# EAGLE schematic LibreServo-v2.2 (EAGLE 7.6.0)
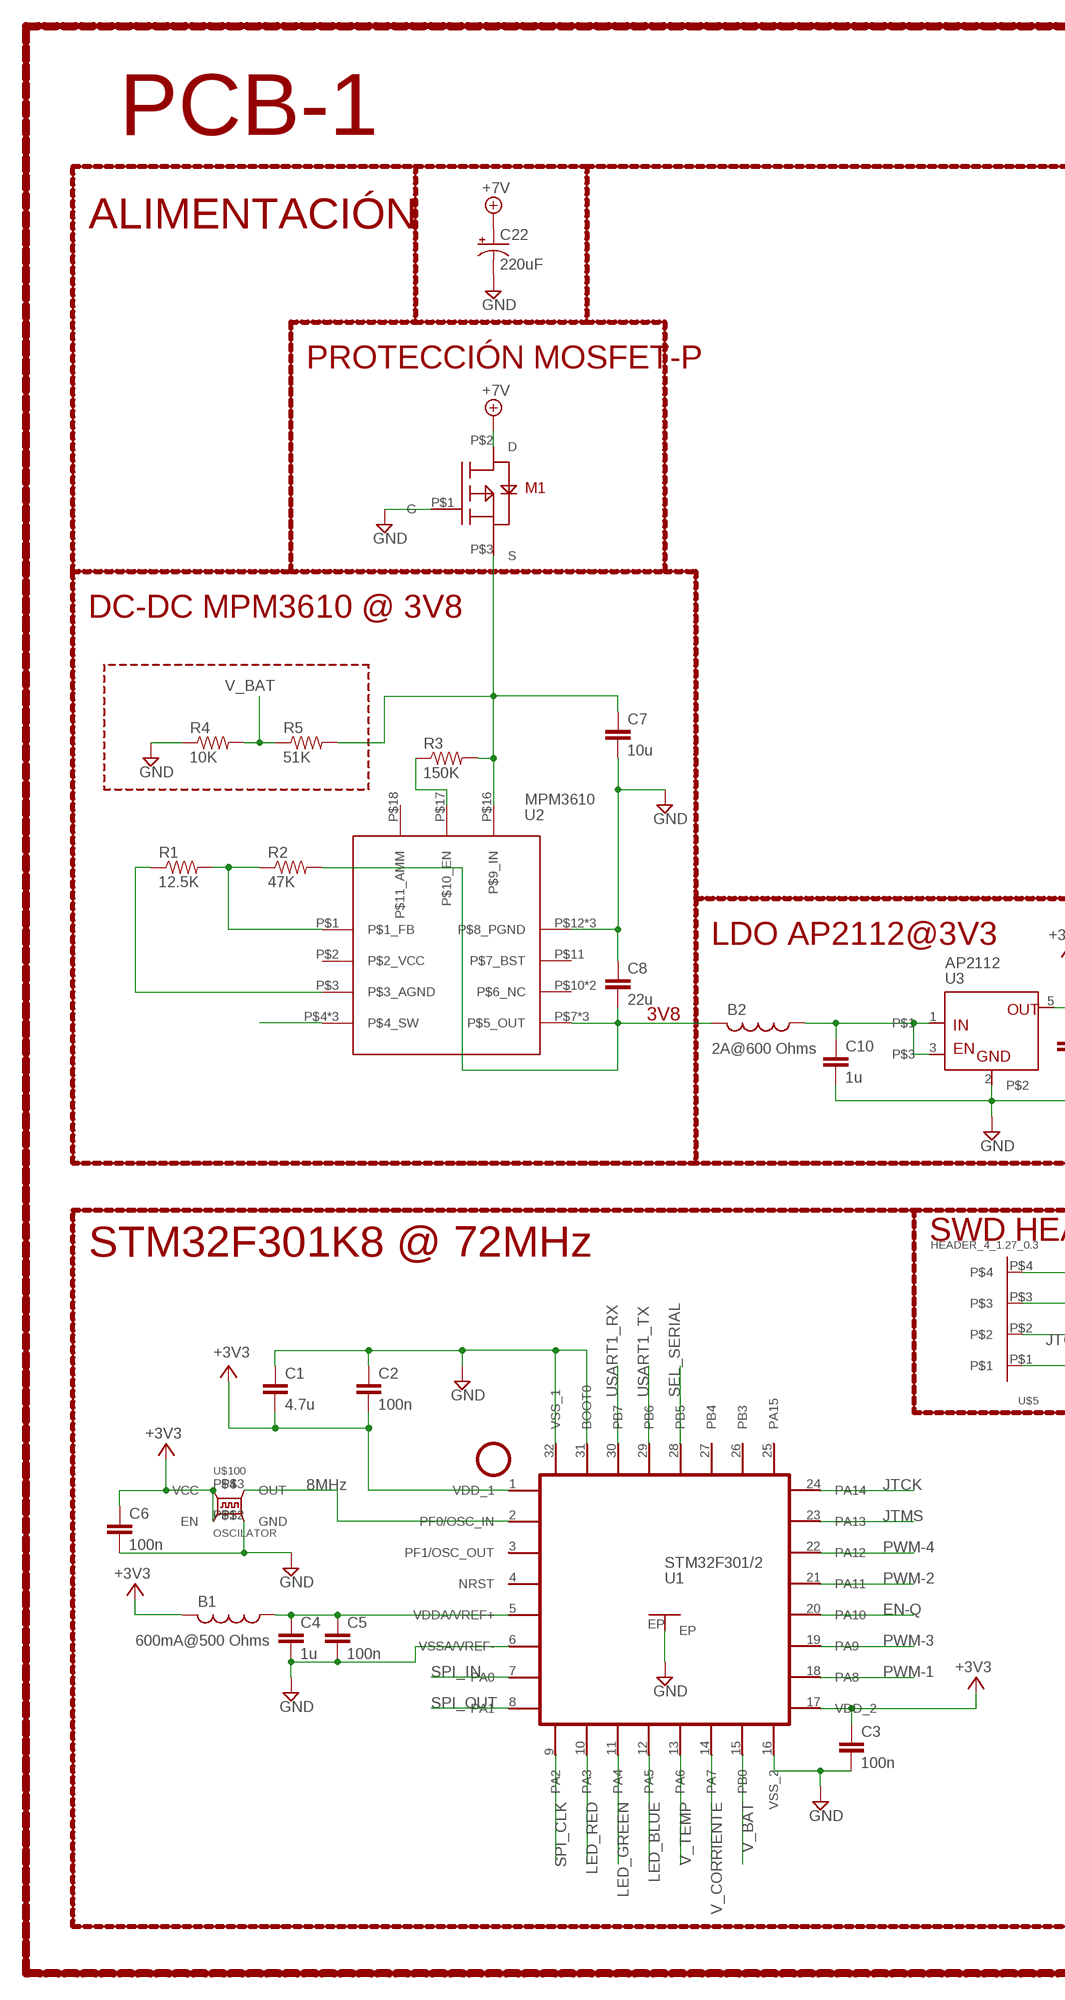
[diagram p0: schematic, sheet 1, part 1 of 2]
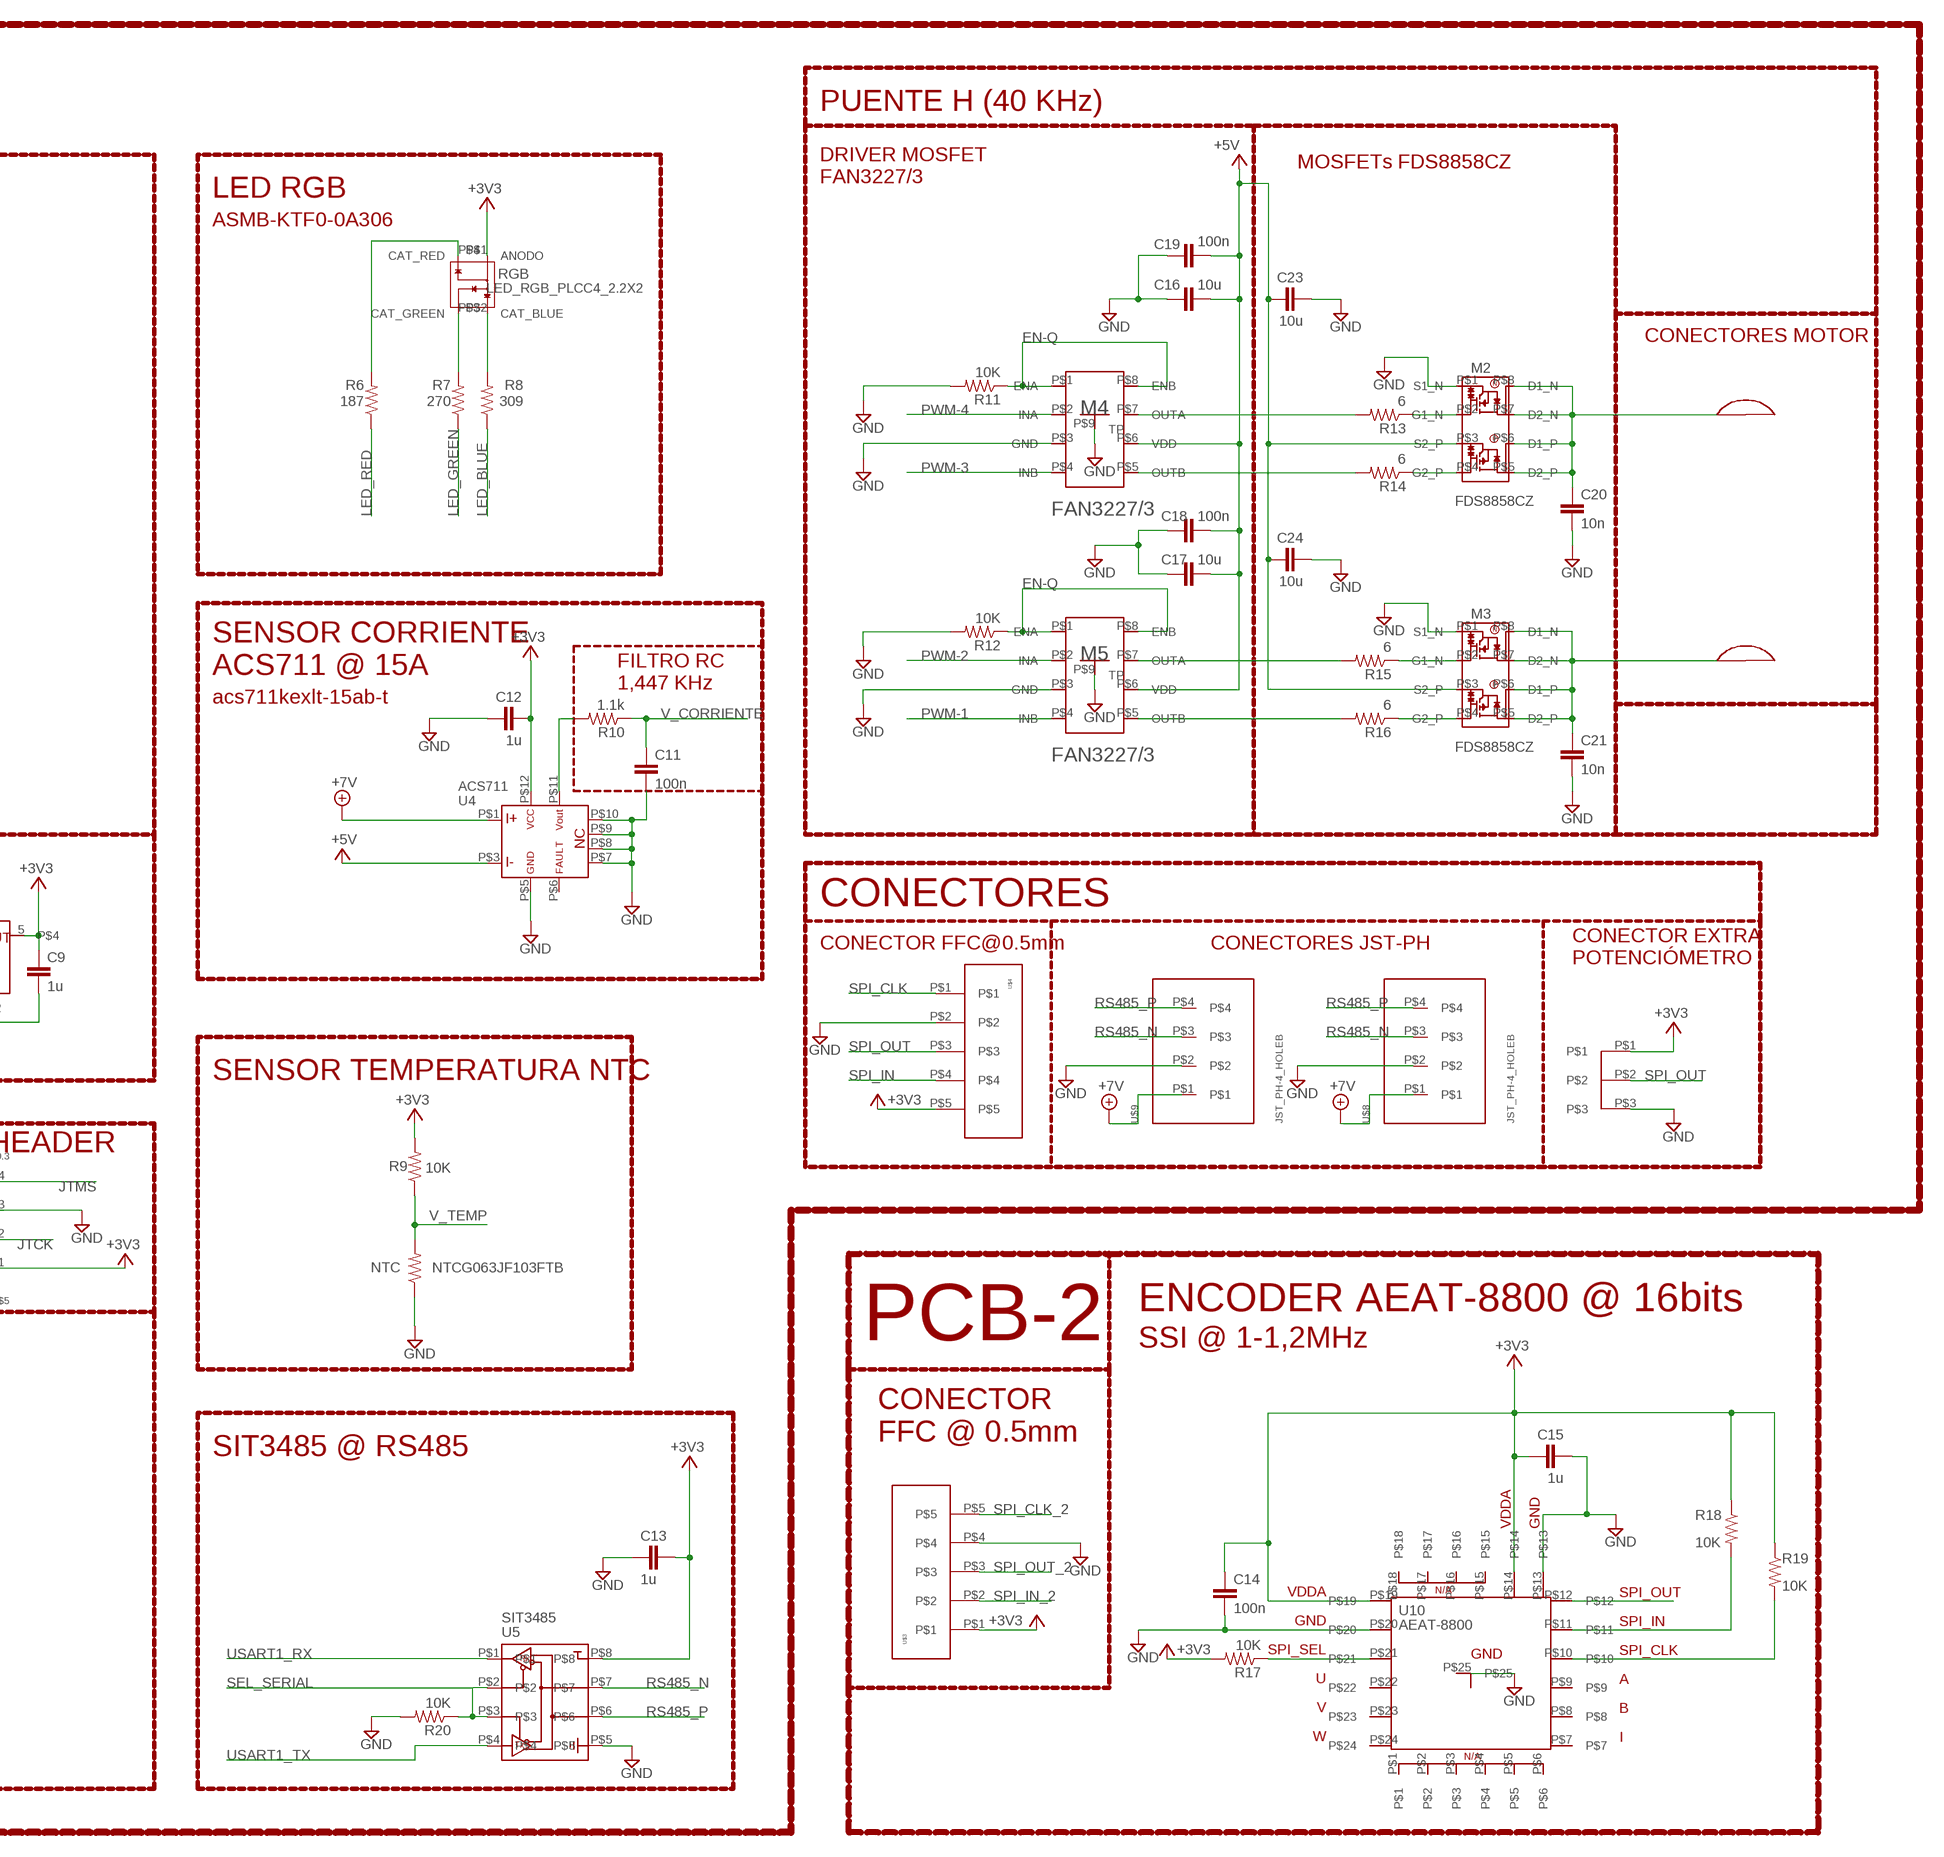
[diagram p1: schematic, sheet 1, part 2 of 2]

## Parts
B1  FERRITE_BEAD_0402  [0402]
B2  FERRITE_BEAD_0603  [0603]
C1  4.7u  C-EU0402  [0402]
C2  100n  C-EU0402  [0402]
C3  100n  C-EU0402  [0402]
C4  1u  C-EU0402  [0402]
C5  100n  C-EU0402  [0402]
C6  100n  C-EU0402  [0402]
C7  10u  C-EU0603  [0603]
C8  22u  C-EU1206  [1206]
C9  1u  C-EU0402  [0402]
C10  1u  C-EU0402  [0402]
C11  100n  C-EU0402  [0402]
C12  1u  C-EU0402  [0402]
C13  1u  C-EU0402  [0402]
C14  100n  C-EU0402  [0402]
C15  1u  C-EU0402  [0402]
C16  10u  C-EU0603  [0603]
C17  10u  C-EU0603  [0603]
C18  100n  C-EU0402  [0402]
C19  100n  C-EU0402  [0402]
C20  10n  C-EU0402  [0402]
C21  10n  C-EU0402  [0402]
C22  220uF  CPOL-USE2,5-6_MIN  [E2,5-6_MIN]
C23  10u  C-EU0603  [0603]
C24  10u  C-EU0603  [0603]
M1  M1  P5103EMA  [SOT23]
M2  FDS8858CZ  [SO-8]
M3  FDS8858CZ  [SO-8]
M4  FAN3227/3  [MLP8]
M5  FAN3227/3  [MLP8]
NTC  R-US0402_MIN  [0402_MIN]
R1  12.5K  R-US0402  [0402]
R2  47K  R-US0402  [0402]
R3  150K  R-US0402  [0402]
R4  10K  R-US0402  [0402]
R5  51K  R-US0402  [0402]
R6  187  R-US0402  [0402]
R7  270  R-US0402  [0402]
R8  309  R-US0402  [0402]
R9  10K  R-US0402  [0402]
R10  1.1k  R-US0402  [0402]
R11  10K  R-US0402  [0402]
R12  10K  R-US0402  [0402]
R13  6  R-US0402  [0402]
R14  6  R-US0402  [0402]
R15  6  R-US0402  [0402]
R16  6  R-US0402  [0402]
R17  10K  R-US0402  [0402]
R18  10K  R-US0402  [0402]
R19  10K  R-US0402  [0402]
R20  10K  R-US0402  [0402]
RGB  LED_RGB_PLCC4_2.2X2  [PLCC-4_2.2X2]
U1  STM32F301/2  STM32F302  [QFN32]
U2  MPM3610  MPM36XX  [MPM36XX]
U3  AP2112  [SOT25]
U4  ACS711  [ACS711-QFN]
U5  SIT3485  RS485-HALF_DUPLEX  [MSOP-8]
U10  AEAT-8800  [QFN24]
U$1  SLOT  [SERVO_SLOT]
U$2  SLOT  [SERVO_SLOT]
U$3  FFC-5  [FFC-5-0.5]
U$4  FFC-5  [FFC-5-0.5]
U$5  HEADER_4_1.27_0.3  [HEADER_4_1.27_0.3]
U$6  POTEN_SERVO  [POTEN_SERVO]
U$8  JST_PH-4_HOLEB  [JST_PH-4_HOLE_B]
U$9  JST_PH-4_HOLEB  [JST_PH-4_HOLE_B]
U$100  OSCILATOR  [OSC-2X1.6]

## Nets
711_OUT: R10.2 U4.P$11
+3V3: B1.2 C1.2 C2.2 C3.1 C6.1 C9.1 C12.2 C13.2 R9.2 RGB.P$1(ANODO) U1.1(VDD_1) U1.17(VDD_2) U3.5 U4.P$12 U5.P$8 U$4.P$5 U$5.P$1 U$6.P$1 U$100.P$1(EN) U$100.P$4(VCC)
+3V3_2: C14.1 C15.1 R17.2 R18.1 R19.1 U10.P$14 U10.P$19 U$3.P$1 ; supply symbol labelled +3V3
+5V: C16.2 C17.2 C18.2 C19.2 C23.1 C24.1 M2.P$3(S2_P) M3.P$3(S2_P) M4.P$6(VDD) M5.P$6(VDD) U4.P$3
+7V: C22.+ M1.P$2(D) U4.P$1 U$8.P$1 U$9.P$1
CLK-8MHZ: U1.2(PF0/OSC_IN) U$100.P$3(OUT)
EN-Q: M4.P$1(ENA) M4.P$8(ENB) M5.P$1(ENA) M5.P$8(ENB) R11.1 R12.1 U1.20(PA10)
GND: C1.1 C2.1 C3.2 C4.2 C5.2 C6.2 C7.2 C8.1 C9.2 C10.2 C11.2 C12.1 C13.1 C16.1 C17.1 C18.1 C19.1 C20.2 C21.2 C22.- C23.2 C24.2 M1.P$1(G) M2.P$1(S1_N) M3.P$1(S1_N) M4.P$3(GND) M4.P$9(TP) M5.P$3(GND) M5.P$9(TP) NTC.1 R4.1 R11.2 R12.2 R20.2 U1.6(VSSA/VREF-) U1.16(VSS_2) U1.31(BOOT0) U1.32(VSS_1) U1.EP U2.P$12(P$8_PGND) U2.P$13(P$8_PGND) U2.P$14(P$8_PGND) U3.2 U4.P$5 U4.P$7 U4.P$8 U4.P$9 U4.P$10 U5.P$5 U$4.P$2 U$5.P$3 U$6.P$3 U$8.P$2 U$9.P$2 U$100.P$2(GND)
GND_2: C14.2 C15.2 U10.P$13 U10.P$20 U10.P$25 U$3.P$4 ; supply symbol labelled GND
IN_AP2112: B2.1 C10.1 U3.1 U3.3
JTCK: U1.24(PA14) U$5.P$2
JTMS: U1.23(PA13) U$5.P$4
LED_BLUE: R8.1 U1.12(PA5)
LED_GREEN: R7.1 U1.11(PA4)
LED_RED: R6.1 U1.10(PA3)
M1-OUT: C7.1 M1.P$3(S) R3.2 R5.2 U2.P$16(P$9_IN)
M2-OUT: C20.1 M2.P$5(D2_P) M2.P$6(D1_P) M2.P$7(D2_N) M2.P$8(D1_N) U$1.P$1
M3-OUT: C21.1 M3.P$5(D2_P) M3.P$6(D1_P) M3.P$7(D2_N) M3.P$8(D1_N) U$2.P$1
M4-OUTA: M4.P$7(OUTA) R13.2
M4-OUTA-IN: M2.P$2(G1_N) R13.1
M4-OUTB: M4.P$5(OUTB) R14.2
M4-OUTB-IN: M2.P$4(G2_P) R14.1
M5-OUTA: M5.P$7(OUTA) R15.2
M5-OUTA-IN: M3.P$2(G1_N) R15.1
M5-OUTB: M5.P$5(OUTB) R16.2
M5-OUTB-IN: M3.P$4(G2_P) R16.1
MPM3610_AGND: R1.1 U2.P$3(P$3_AGND)
MPM3610_EN: R3.1 U2.P$17(P$10_EN)
MPM3610_FB: R1.2 R2.1 U2.P$1(P$1_FB)
MPM3610_SW: U2.P$4(P$4_SW) U2.P$5(P$4_SW) U2.P$6(P$4_SW)
N$1: R6.2 RGB.P$4(CAT_RED)
N$4: R7.2 RGB.P$3(CAT_GREEN)
N$5: R8.2 RGB.P$2(CAT_BLUE)
N$17: R17.1 U10.P$21
OUT_MPM3610: B2.2 C8.2 R2.2 U2.P$7(P$5_OUT) U2.P$8(P$5_OUT) U2.P$9(P$5_OUT)
PWM-1: M5.P$4(INB) U1.18(PA8)
PWM-2: M5.P$2(INA) U1.21(PA11)
PWM-3: M4.P$4(INB) U1.19(PA9)
PWM-4: M4.P$2(INA) U1.22(PA12)
RS485_N [Diff]: U5.P$7 U$8.P$3 U$9.P$3
RS485_P [Diff]: U5.P$6 U$8.P$4 U$9.P$4
SEL_SERIAL: R20.1 U1.28(PB5) U5.P$2 U5.P$3
SPI_CLK: U1.9(PA2) U$4.P$1
SPI_CLK_2: R19.2 U10.P$10 U$3.P$5
SPI_IN: U1.7(PA0) U$4.P$4
SPI_IN_2: R18.2 U10.P$11 U$3.P$2
SPI_OUT: U1.8(PA1) U$4.P$3 U$6.P$2
SPI_OUT_2: U10.P$12 U$3.P$3
USART1_RX: U1.30(PB7) U5.P$1
USART1_TX: U1.29(PB6) U5.P$4
V_BAT: R4.2 R5.1 U1.15(PB0)
V_CORRIENTE: C11.1 R10.1 U1.14(PA7)
V_TEMP: NTC.2 R9.1 U1.13(PA6)
VDDA-FILTRADO: B1.1 C4.1 C5.1 U1.5(VDDA/VREF+)
Unconnected: U1.3(PF1/OSC_OUT) U1.4(NRST) U1.25(PA15) U1.26(PB3) U1.27(PB4) U2.P$2(P$2_VCC) U2.P$10(P$6_NC) U2.P$11(P$7_BST) U2.P$15(P$6_NC) U2.P$18(P$11_AMM) U4.P$6 U10.P$1 U10.P$2 U10.P$3 U10.P$4 U10.P$5 U10.P$6 U10.P$7 U10.P$8 U10.P$9 U10.P$15 U10.P$16 U10.P$17 U10.P$18 U10.P$22 U10.P$23 U10.P$24 U$1.P$2 U$2.P$2

## Notes on the sheet
- PUENTE H (40 KHz)
- PCB-1
- MOSFETs FDS8858CZ
- DRIVER MOSFET
  FAN3227/3
- LED RGB
- ALIMENTACIÓN
- ASMB-KTF0-0A306
- PROTECCIÓN MOSFET-P | CONECTORES MOTOR
- M1
- DC-DC MPM3610 @ 3V8
- SENSOR CORRIENTE
  ACS711 @ 15A
- FILTRO RC
  1,447 KHz
- acs711kexlt-15ab-t
- LDO AP2112@3V3
- CONECTORES
- 3V8
- CONECTOR FFC@0.5mm | CONECTORES JST-PH
- CONECTOR EXTRA
  POTENCIÓMETRO
- 2A@600 Ohms
- SENSOR TEMPERATURA NTC
- SWD HEADER
- STM32F301K8 @ 72MHz
- NTCG063JF103FTB
- ENCODER AEAT-8800 @ 16bits
- PCB-2 | SSI @ 1-1,2MHz
- 8MHz
- CONECTOR
  FFC @ 0.5mm
- SIT3485 @ RS485
- 600mA@500 Ohms

## Library data of the parts
B1 = Propio:FERRITE_BEAD_0402
B2 = Propio:FERRITE_BEAD_0603
C1-C21 C23 C24 = Propio:C-EU
C22 = rcl:CPOL-US: POLARIZED CAPACITOR, American symbol
M1 = Propio:P5103EMA
M2 M3 = Propio:FDS8858CZ
M4 M5 = Propio:FAN3227/3
NTC R1-R20 = Propio:R-US
RGB = Propio:LED_RGB_PLCC4_2.2X2
U1 = Propio:STM32F302
U2 = Propio:MPM36XX
U3 = Propio:AP2112
U4 = Propio:ACS711
U5 = Propio:RS485-HALF_DUPLEX
U10 = Propio:AEAT-8800
U$1 U$2 = Propio:SLOT
U$3 U$4 = Propio:FFC-5
U$5 = Propio:HEADER_4
U$6 = Propio:POTEN_SERVO
U$8 U$9 = Propio:JST_PH-4_HOLE
U$100 = Propio:OSCILATOR

## Net classes
1 Diff: width 0.178 mm, clearance 0.152 mm